# Altium project power supply.PrjPcb
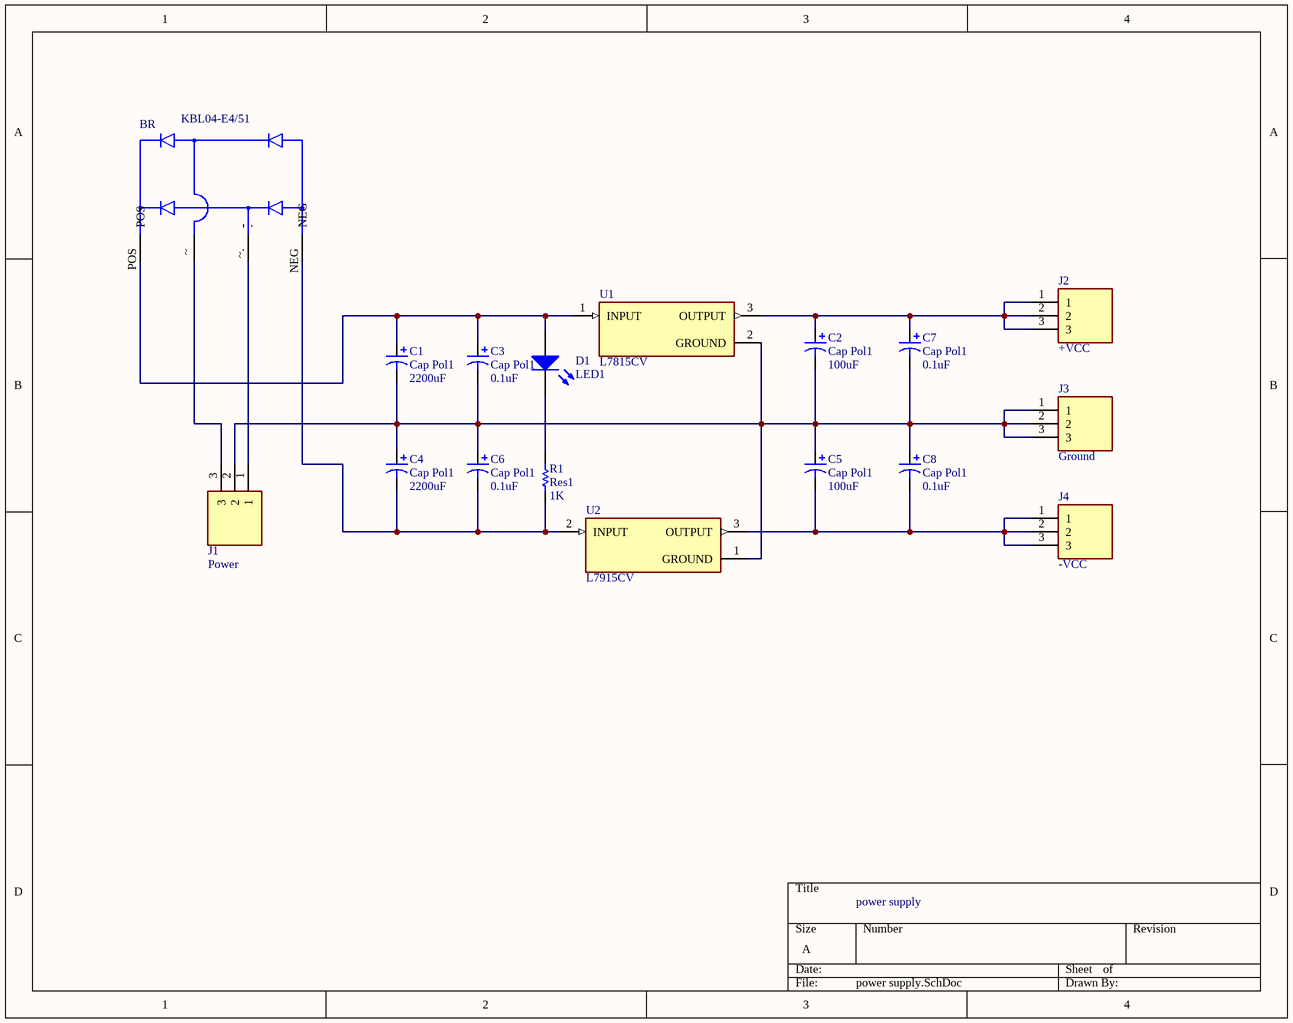
[diagram p0: power supply.SchDoc]
1 sheet, 17 parts. Net scope: global (net labels, ports and power ports of the same name join across sheets).
Board file: power supply.PcbDoc

## Sheet power supply.SchDoc
size A

### Parts
BR  KBL04-E4/51  [DIOB_KBL04-E4/51]
C1  Cap Pol1  value 2200uF  [RB7.6-15]
C2  Cap Pol1  value 100uF  [RB7.6-15]
C3  Cap Pol1  value 0.1uF  [RB7.6-15]
C4  Cap Pol1  value 2200uF  [RB7.6-15]
C5  Cap Pol1  value 100uF  [RB7.6-15]
C6  Cap Pol1  value 0.1uF  [RB7.6-15]
C7  Cap Pol1  value 0.1uF  [RB7.6-15]
C8  Cap Pol1  value 0.1uF  [RB7.6-15]
D1  LED1  [LED-1]
J1  Power  [CUI_TB005-762-03BE]
J2  +VCC  [CUI_TB005-762-03BE]
J3  Ground  [CUI_TB005-762-03BE]
J4  -VCC  [CUI_TB005-762-03BE]
R1  Res1  value 1K  [AXIAL-0.3]
U1  L7815CV  [TO255P1040X460X1935-3]
U2  L7915CV  [TO255P1040X460X1935-3]

### Nets
NetBR_NEG: BR.NEG C4.2 C6.2 R1.1 U2.2(INPUT)
NetBR_POS: BR.POS C1.1 C3.1 D1.1(A) U1.1(INPUT)
NetBR_~: BR.~(\) J1.3
NetBR_~.: BR.~.(~{.}) J1.1
NetC1_2: C1.2 C2.2 C3.2 C4.1 C5.1 C6.1 C7.2 C8.1 J1.2 J3.1 J3.2 J3.3 U1.2(GROUND) U2.1(GROUND)
NetC2_1: C2.1 C7.1 J2.1 J2.2 J2.3 U1.3(OUTPUT)
NetC5_2: C5.2 C8.2 J4.1 J4.2 J4.3 U2.3(OUTPUT)
NetD1_2: D1.2(K) R1.2

### Notes on the sheet
- power supply

### Library data of the parts
BR = KBL04-E4/51: Bridge Rectifier Single Phase Standard 400V Through Hole KBL; MF: Vishay; Price: None; SnapEDA_Link: https://www.snapeda.com/parts/KBL04-E4/51/Vishay%20Semiconductor%20Diodes%20Division/view-part/44515/?ref=snap; MP: KBL04-E4/51; Availability: Unavailable; Value: *; Package: SIP-4 Vishay
C1-C8 = Cap Pol1: Polarized Capacitor (Radial); Published: 8-Jun-2000; LatestRevisionDate: 17-Jul-2002; LatestRevisionNote: Re-released for DXP Platform.; PackageReference: RB7.6-15; Publisher: Altium Limited; PackageDescription: Polarized Capacitor (Radial); 2 Leads
D1 = LED1: Typical RED GaAs LED; Published: 8-Jun-2000; LatestRevisionDate: 08-Jul-2005; LatestRevisionNote: Mech Layer 1 removed.; PackageReference: LED-1; Publisher: Altium Limited; PackageDescription: LED; 2 Leads
J1-J4 = TB005-762-03BE: 2~24 Poles, Screw Type, Horizontal, 7.62 Pitch, 26~10 _AWG_, Terminal Block Connector; MF: CUI Devices; CUI_purchase_URL: https://www.cuidevices.com/product/interconnect/connectors/terminal-blocks/tb005-762-series?utm_source=snapeda.com&utm_medium=referral&utm_campaign=snapedaBOM; MP: TB005-762-03BE; SnapEDA_Link: https://www.snapeda.com/parts/TB005-762-03BE/CUI%20Devices/view-part/3590987/?ref=snap; Price: None; Package: None; Availability: Unavailable; Value: *
R1 = Res1: Resistor; Published: 8-Jun-2000; LatestRevisionDate: 17-Jul-2002; LatestRevisionNote: Re-released for DXP Platform.; PackageReference: AXIAL-0.3; Publisher: Altium Limited; PackageDescription: Axial Device, Thru-Hole; 2 Leads; 0.3 in Pin Spacing
U1 = L7815CV: Linear Voltage Regulator IC 1 Output 1.5A TO-220AB; MF: STMicroelectronics; Package: TO-220 STMicroelectronics; MP: L7815CV; Availability: Unavailable; Price: None; Value: *; SnapEDA_Link: https://www.snapeda.com/parts/L7815CV/STMicroelectronics/view-part/4730/?ref=snap
U2 = L7915CV: Linear Voltage Regulator IC 1 Output 1.5A TO-220AB; MF: STMicroelectronics; Value: *; Package: TO-220 STMicroelectronics; Availability: Unavailable; SnapEDA_Link: https://www.snapeda.com/parts/L7915CV/STMicroelectronics/view-part/8087/?ref=snap; MP: L7915CV; Price: None